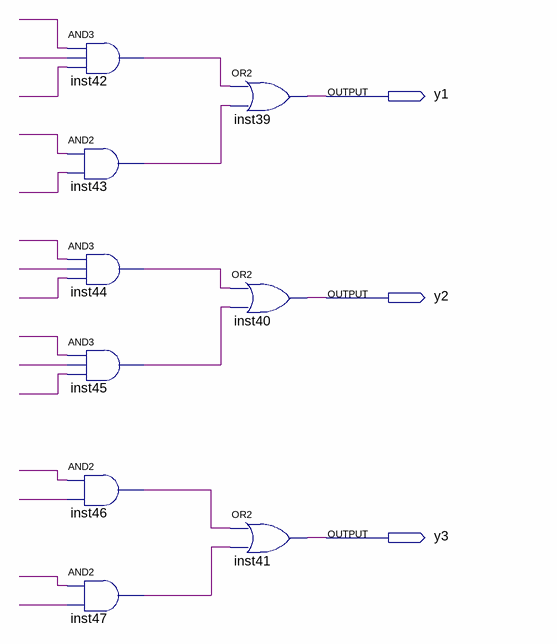
[diagram p0: schematic sheet]
// Quartus schematic output.bdf as structural Verilog: 9 symbols, 3 pins
module \output  (
  output y1,
  output y2,
  output y3
);

  wire inst42_out, inst43_out, inst44_out, inst45_out, inst46_out, inst47_out, undriven, undriven_2,
       undriven_3, undriven_4, undriven_5, undriven_6, undriven_7, undriven_8, undriven_9, undriven_10,
       undriven_11, undriven_12, undriven_13, undriven_14, undriven_15;

  and inst42 (inst42_out, undriven, undriven_11, undriven_2);
  and inst43 (inst43_out, undriven_4, undriven_3);
  and inst44 (inst44_out, undriven_5, undriven_12, undriven_6);
  and inst45 (inst45_out, undriven_7, undriven_13, undriven_8);
  and inst46 (inst46_out, undriven_9, undriven_14);
  and inst47 (inst47_out, undriven_10, undriven_15);
  or inst39 (y1, inst42_out, inst43_out);
  or inst40 (y2, inst44_out, inst45_out);
  or inst41 (y3, inst46_out, inst47_out);
endmodule
